# Altium schematic sheet ROSV_Arch_Idea2.SchDoc
size A4; DocumentNumber: 2; Revision: 2; SheetNumber: 2; SheetTotal: 5; DrawnBy: T. Burns; Organization: N/A
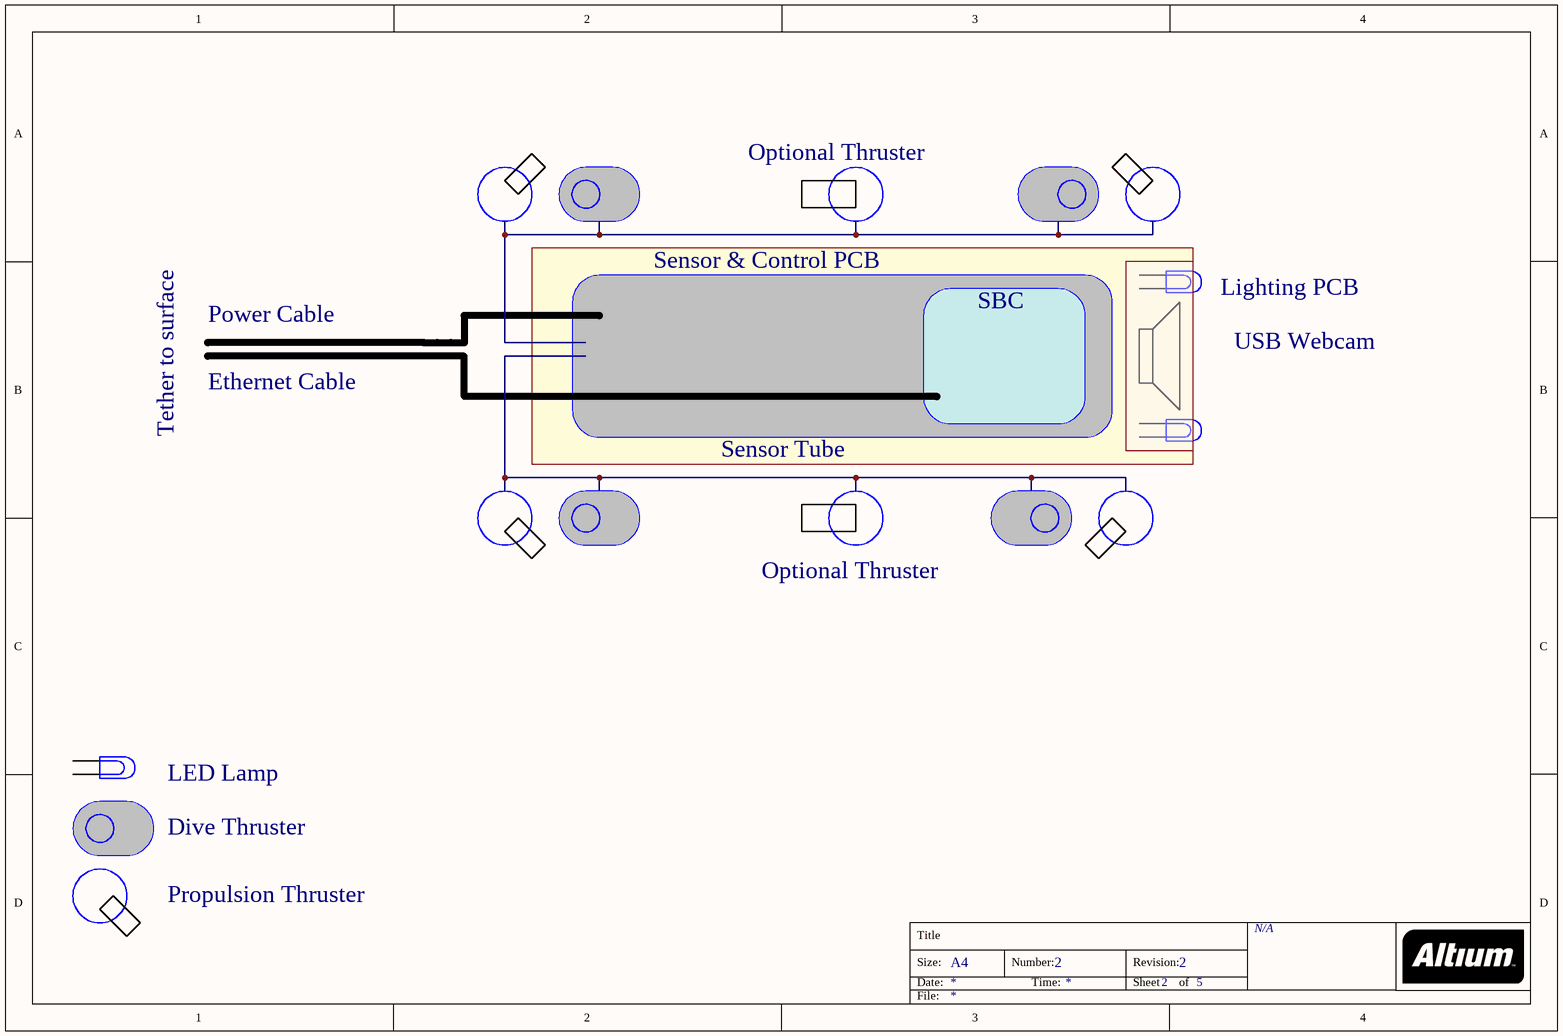
[diagram p0: ROSV_Arch_Idea2.SchDoc]

## Parts
(Parts that share a designator on the sheet are numbered #1, #2 ... from top to bottom, then left to right.)
DS?#1  Lamp  [PIN2]  (value not drawn)
DS?#2  Lamp  [PIN2]  (value not drawn)
DS?#3  Lamp  [PIN2]  (value not drawn)

## Nets

Not connected (* = marked no-connect by the designer): DS?#1 1 2; DS?#2 1 2; DS?#3 1 2

## Notes on the sheet
- Optional Thruster
- Sensor & Control PCB
- SBC
- Lighting PCB
- Power Cable
- USB Webcam
- Tether to surface
- Ethernet Cable
- Sensor Tube
- LED Lamp
- Dive Thruster
- Propulsion Thruster
- Title
- Size:
- Date:
- A4
- Number:
- Time:
- Revision:
- Sheet
- of
- File:

## Library data of the parts
DS?#1-DS?#3 = Lamp: Incandescent Bulb; Published: 24-Mar-1999; LatestRevisionDate: 17-Jul-2002; LatestRevisionNote: Re-released for DXP Platform.; PackageReference: PIN2; Publisher: Altium Limited